# Altium schematic sheet Solar_Charger.SchDoc
size A4; SheetNumber: 1; SheetTotal: 1
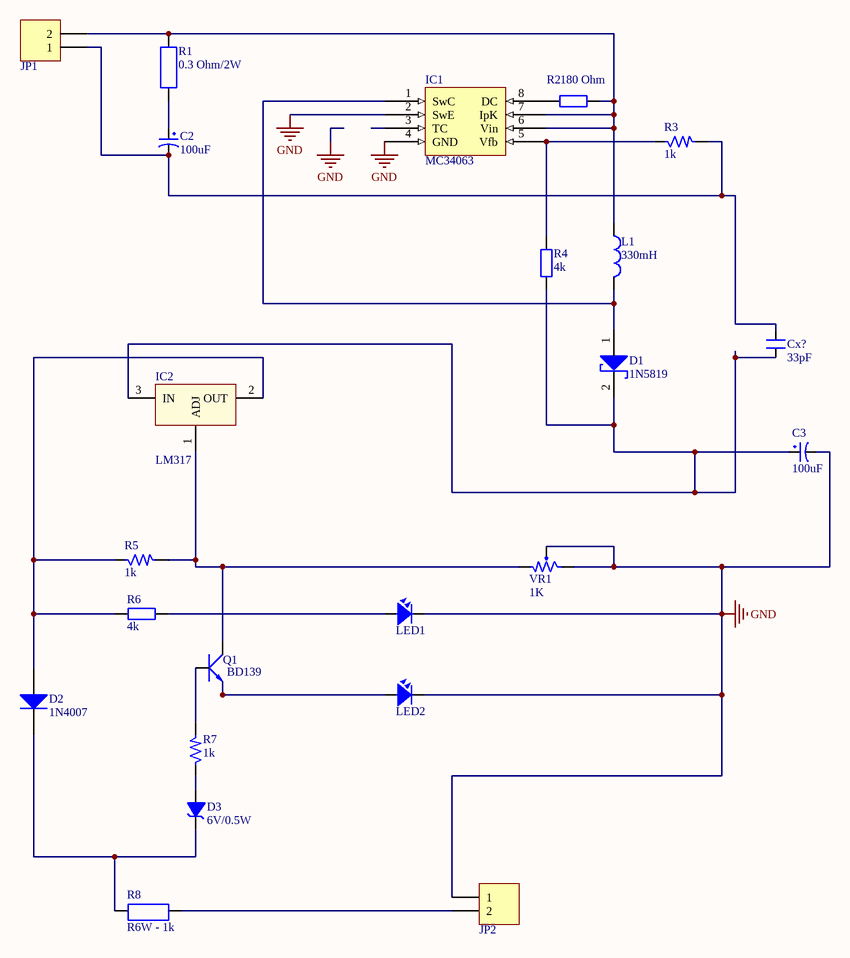
[diagram p0: Solar_Charger.SchDoc]

## Parts
C2  100uF  [CP1/2.5]
C3  100uF  [CP1/2.5]
Cx?  33pF  [CN1]
D1  1N5819  [DO-201]
D2  1N4007  [DO-201]
D3  6V/0.5W  [DZ0.5A]
IC1  MC34063  [SOP8]
IC2  LM317  [QTO-220]
JP1  Header 2_1  [HED2]  (value not drawn)
JP2  Header 2_1  [HED2]  (value not drawn)
L1  330mH  [L01]
LED1  LED  [LED-3]  (value not drawn)
LED2  LED  [LED-3]  (value not drawn)
Q1  BD139  [QTO-220]
R1  0.3 Ohm/2W  [R2W]
R2  180 Ohm  [R1/4W]
R3  1k  [0805_Res]
R4  4k  [R1/4W]
R5  1k  [0805_Res]
R6  4k  [R1/4W]
R7  1k  [0805_Res]
R8  R6W - 1k  [R5W]
VR1  1K  [VR]

## Nets
GND: C3.2 IC1.2(SwE) IC1.4(GND) JP2.1 LED1.2 LED2.2 VR1.2 VR1.3
NetC2_1: C2.1 R1.1
NetC2_2: C2.2 Cx?.2 JP1.1 R3.2
NetC3_1: C3.1 Cx?.1 D1.2(K) IC2.3(IN) R4.1
NetD1_1: D1.1(A) IC1.1(SwC) L1.2
NetD2_1: D2.1(A) IC2.2(OUT) R5.1 R6.2
NetD2_2: D2.2(K) D3.2(K) R8.1
NetD3_1: D3.1(A) R7.1
NetIC1_5: IC1.5(Vfb) R3.1 R4.2
NetIC1_6: IC1.6(Vin) IC1.7(IpK) JP1.2 L1.1 R1.2 R2.2
NetIC1_8: IC1.8(DC) R2.1
NetIC2_1: IC2.1(ADJ) Q1.2(C) R5.2 VR1.1
NetJP2_2: JP2.2 R8.2
NetLED1_1: LED1.1 R6.1
NetLED2_1: LED2.1 Q1.3(E)
NetQ1_1: Q1.1(B) R7.2

Not connected (* = marked no-connect by the designer): IC1 3(TC)

## Library data of the parts
C2 C3 = CP2: C 47uF/50V , 220uF/16V; Value: 47uF/16 - 50V; Description 1: 470uF/6,3V - 330uF/10V - 220uF/16V; Description 2: 100uF/25V - 35V - 47uF/50V - 22uF/100V; Description 3: 33uF => 47uF/63V - 1uF => 4,7uF/160V; Description 4: 1uF => 2,2uF/250V - 1uF/350V
Cx? = CN0: Cremic For Xtal 1pF => 100pF; Value: 33pF
D3 = DZ: Diode Zenner; Value: 3v3
IC1 = SO8
IC2 = LM317: Adj Voltage +1.2 -> +37V; Value: LM317
JP1 JP2 = Header 2_1: Header, 2-Pin; Manufacturer: Generic Components; Class: Connector; Value: Header 2
L1 = L1: Inductor; Value: 150 mH
LED1 LED2 = LED: LED Single colour Green and Red; Value: LED 3 ly Single Colour; Manufacture: *; Unit Price: *; Part Number: *
R1 = R2W: Resistor 2W; Value: R2W - 47
R2 R4 R6 = R1/4W: Resistor 1/4W; Value: R1/4W - 1K
R3 R5 R7 = R: Resistor 1/4W; Value: R1/4W - 1K; Manufacture: *; Part Number: *; Unit Price: *
R8 = R5W: Resistor 5W; Value: R5W - 0,47R
VR1 = VR1: Var Resistor; Value: VR 10K